# Altium schematic sheet ESP826.SchDoc
size A3; SheetNumber: 3; SheetTotal: 4
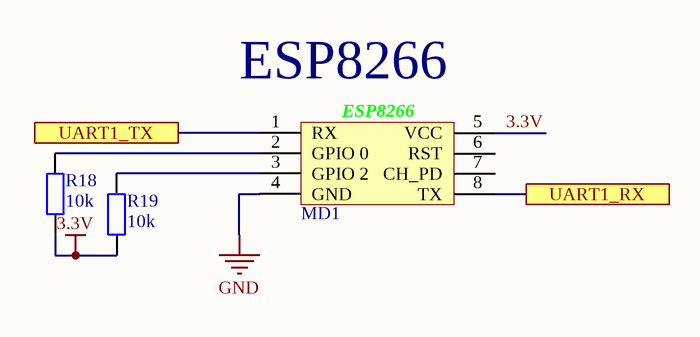
[diagram p0: ESP826.SchDoc]

## Parts
MD1  ESP8266 Module  [ESP2866 Module]  (value not drawn)
R18  10k  [tro smd 0603]
R19  10k  [tro smd 0603]

## Ports
UART1_RX, UART1_TX

## Nets
3.3V: MD1.5(VCC) R18.1 R19.1
GND: MD1.4(GND)
UART1_RX: MD1.8(TX) ; port UART1_RX
UART1_TX: MD1.1(RX) ; port UART1_TX
NetMD1_2: MD1.2(GPIO_0) R18.2
NetMD1_3: MD1.3(GPIO_2) R19.2

Not connected (* = marked no-connect by the designer): MD1 6(RST) 7(CH_PD)

## Notes on the sheet
- (near MD1) ESP8266
- (in symbol ESP8266 Module) ESP8266

## Library data of the parts
R18 R19 = Tro 0603 1% 10k: Dán; Don_Vi: Con; So_Chan: 2; Ten_Linh_Kien: Trở 0603 1% 10k; Ma_Hang: MH006333; Chung_Loai: Dán; Kieu_Chan: *